# EAGLE design shrew-mega-integrated (EAGLE 7.6.0)
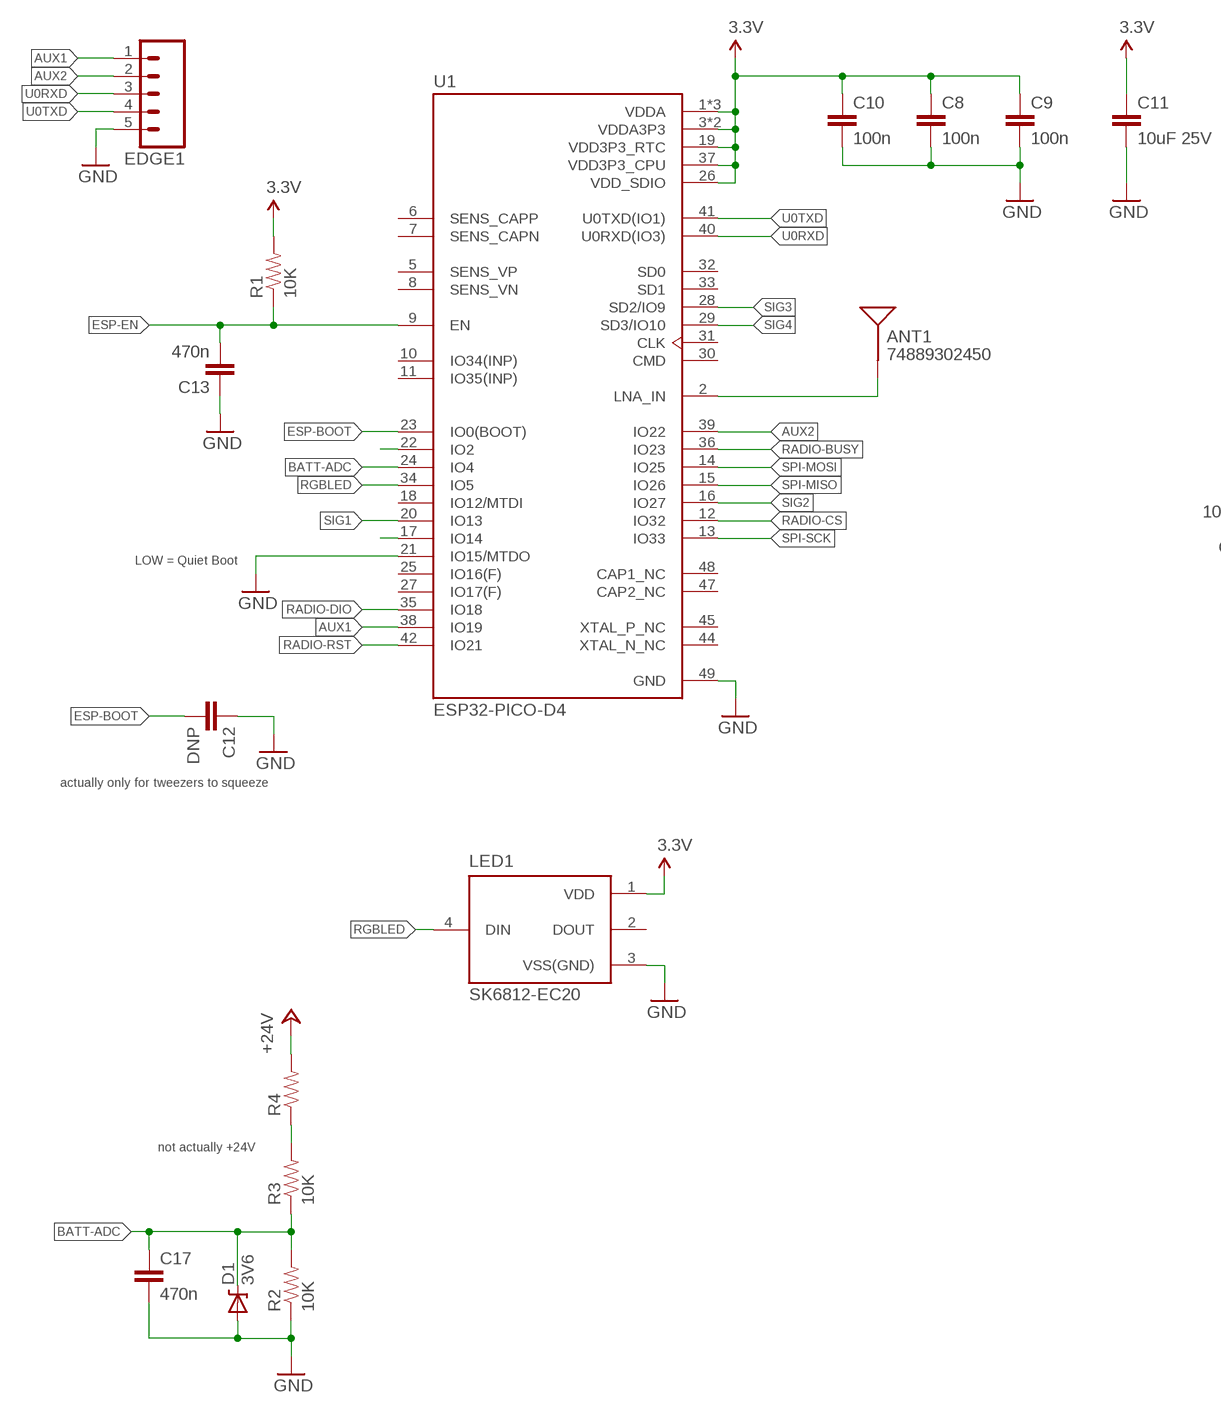
[diagram p0: schematic, sheet 1, part 1 of 2]
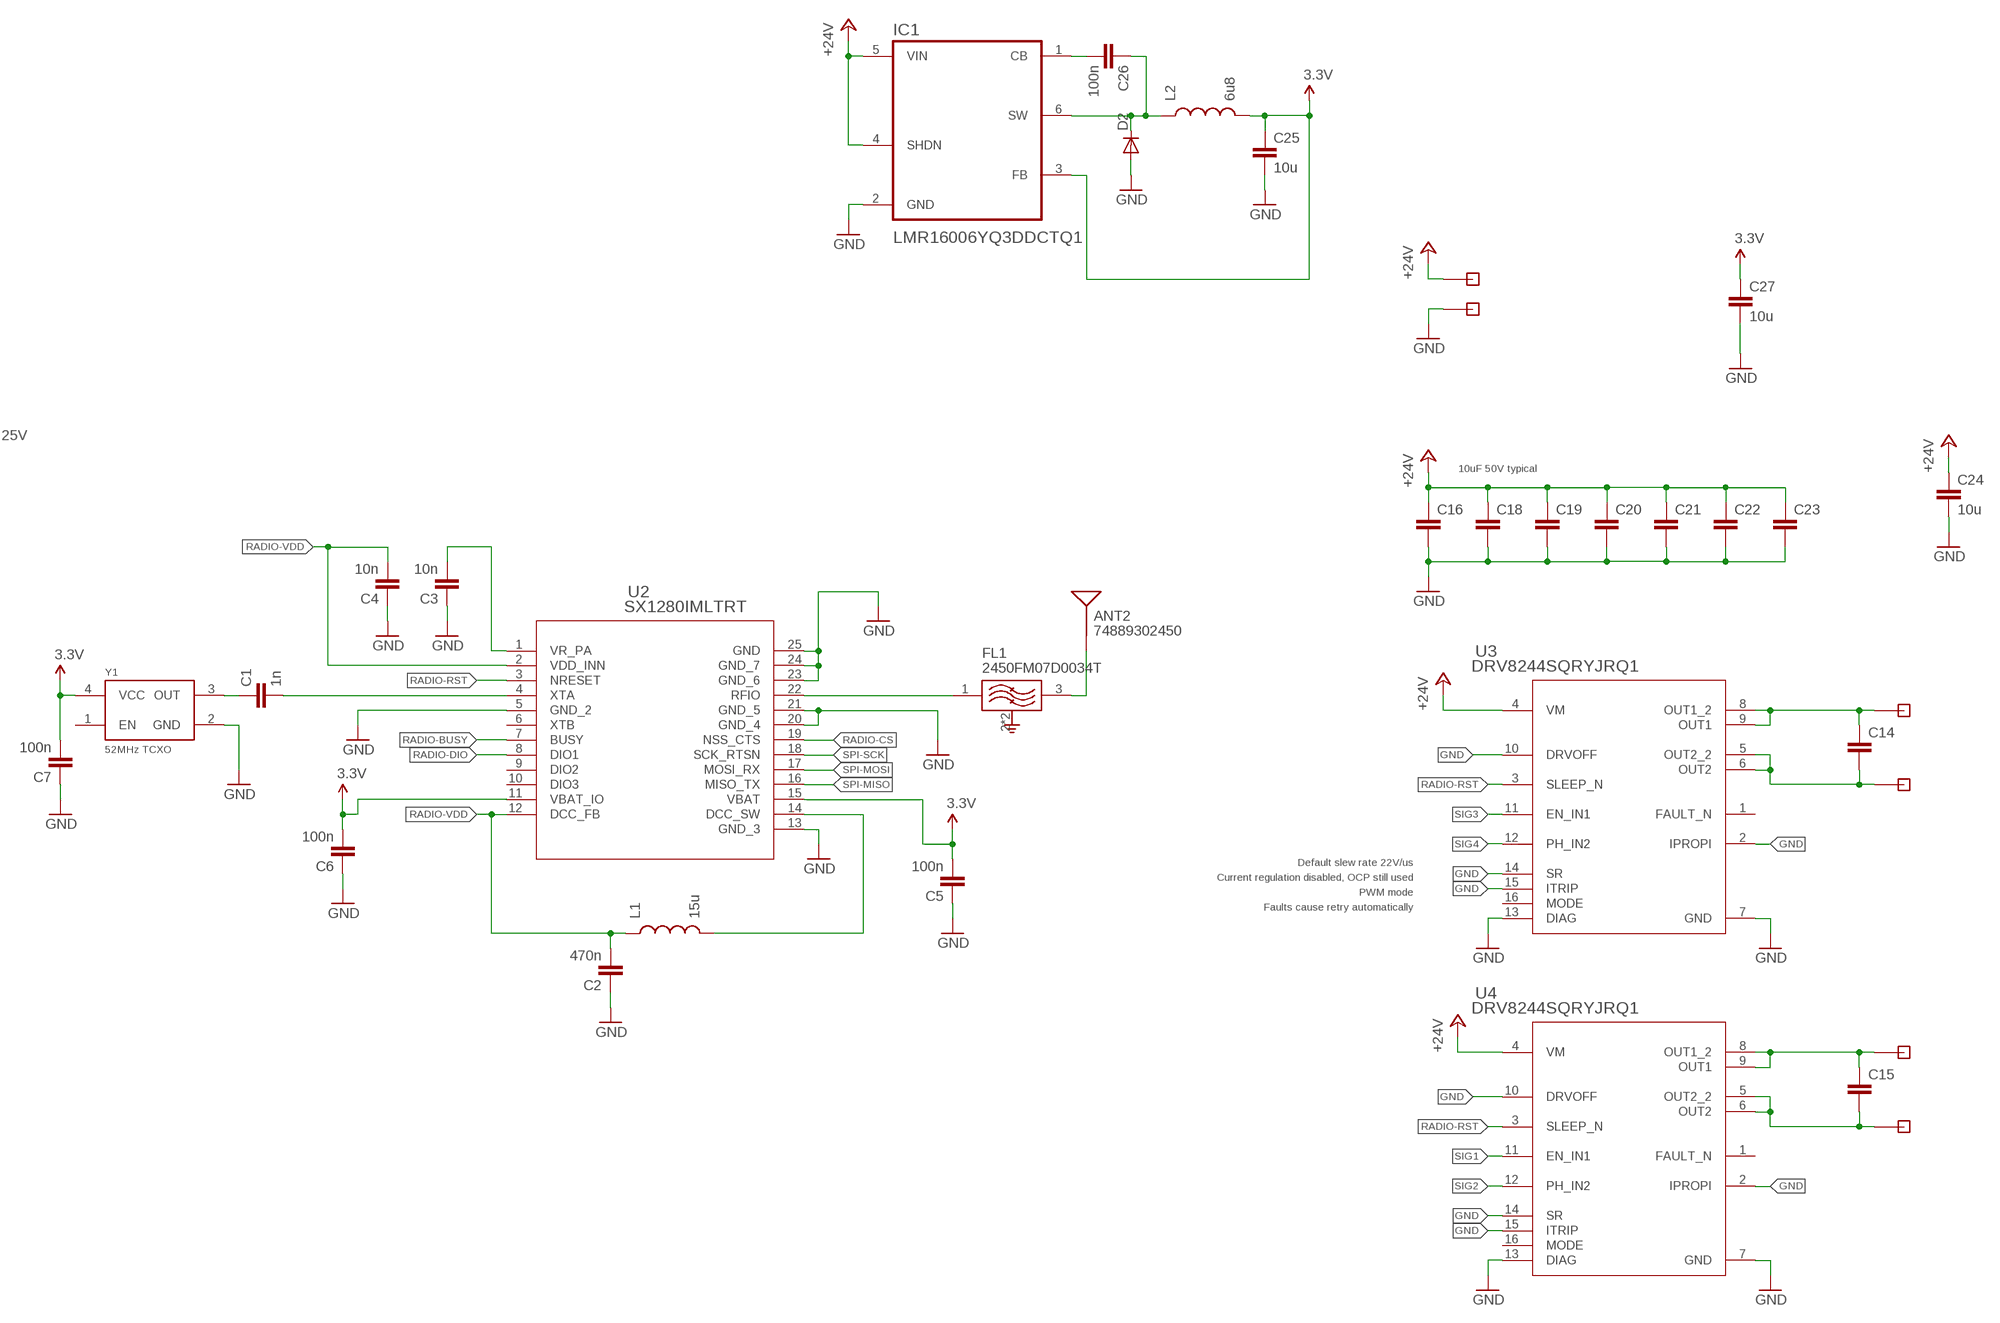
[diagram p1: schematic, sheet 1, part 2 of 2]

## Parts
ANT1  74889302450  ANTENNA2SMD  [ANTENNA-CHIP2]
ANT2  74889302450  ANTENNA2SMD  [ANTENNA-CHIP2]
C1  1n  CAP0402-REV  [0402-REV]
C2  470n  CAP0402-REV  [0402-REV]
C3  10n  CAP0402-REV  [0402-REV]
C4  10n  CAP0402-REV  [0402-REV]
C5  100n  CAP0402-REV  [0402-REV]
C6  100n  CAP0402-REV  [0402-REV]
C7  100n  CAP0402-REV  [0402-REV]
C8  100n  CAP0402-REV  [0402-REV]
C9  100n  CAP0402-REV  [0402-REV]
C10  100n  CAP0402-REV  [0402-REV]
C11  10uF 25V  CAP0805  [0805]
C12  DNP  CAP0402-CAP  [0402-CAP]
C13  470n  CAP0402-REV  [0402-REV]
C14  CAP0402-CAP  [0402-CAP]
C15  CAP0402-CAP  [0402-CAP]
C16  CAP0805  [0805]
C17  470n  CAP0402-REV  [0402-REV]
C18  CAP0805  [0805]
C19  CAP0805  [0805]
C20  CAP0805  [0805]
C21  CAP0805  [0805]
C22  CAP0805  [0805]
C23  CAP0805  [0805]
C24  10u  CAP0805  [0805]
C25  10u  CAP0805  [0805]
C26  100n  CAP0402-REV  [0402-REV]
C27  10u  CAP0805  [0805]
D1  3V6  DIODE-ZENER-BZT52  [SOD-323]
D2  DIODESOD  [SOD-323]
EDGE1  M05PTH  [1X05]
FL1  2450FM07D0034T  [FIL_2450FM07D0034T]
IC1  LMR16006YQ3DDCTQ1  LMR16006XDDCR  [SOT95P280X110-6N]
L1  15u  INDUCTOR0805  [0805]
L2  6u8  INDUCTOR0805  [0805]
LED1  SK6812-EC20  [SK6812-EC20]
R1  10K  RESISTOR0402-REV  [0402-REV]
R2  10K  RESISTOR0402-REV  [0402-REV]
R3  10K  RESISTOR0402-REV  [0402-REV]
R4  RESISTOR0402-RES  [0402-RES]
U1  ESP32-PICO-D4  [PQFN50P700X700X104-49N]
U2  SX1280IMLTRT  [QFN24_4X4_SEM]
U3  DRV8244SQRYJRQ1  [RYJ0016A-MFG]
U4  DRV8244SQRYJRQ1  [RYJ0016A-MFG]
X1  PIN-1X-BIG  [PAD-1X-BIG]
X2  PIN-1X-BIG  [PAD-1X-BIG]
X3  PIN-1X-BIG  [PAD-1X-BIG]
X4  PIN-1X-BIG  [PAD-1X-BIG]
X5  PIN-1X-BIG  [PAD-1X-BIG]
X6  PIN-1X-BIG  [PAD-1X-BIG]
Y1  52MHz TCXO  OSCILLATOR-TG2016SMN  [OSC_TG2016SMN_50.0000M-ECGNNMB]

## Nets
3.3V: C5.2 C6.2 C7.2 C8.1 C9.1 C10.1 C11.1 C25.1 C27.1 IC1.3(FB) L2.2 LED1.1(VDD) R1.2 U1.1(VDDA) U1.3(VDDA3P3) U1.4(VDDA3P3) U1.19(VDD3P3_RTC) U1.26(VDD_SDIO) U1.37(VDD3P3_CPU) U1.43(VDDA) U1.46(VDDA) U2.11(VBAT_IO) U2.15(VBAT) Y1.4(VCC)
+24V: C16.1 C18.1 C19.1 C20.1 C21.1 C22.1 C23.1 C24.1 IC1.4(SHDN) IC1.5(VIN) R4.2 U3.4(VM) U4.4(VM) X5.1
AUX1: EDGE1.1 U1.38(IO19)
AUX2: EDGE1.2 U1.39(IO22)
BATT-ADC: C17.1 D1.1(C) R2.2 R3.1 U1.24(IO4)
ESP-BOOT: C12.2 U1.23(IO0(BOOT))
ESP-EN: C13.2 R1.1 U1.9(EN)
GND: C2.1 C3.1 C4.1 C5.1 C6.1 C7.1 C8.2 C9.2 C10.2 C11.2 C12.1 C13.1 C16.2 C17.2 C18.2 C19.2 C20.2 C21.2 C22.2 C23.2 C24.2 C25.2 C27.2 D1.2(A) D2.2(A) EDGE1.5 IC1.2(GND) LED1.3(VSS(GND)) R2.1 U1.21(IO15/MTDO) U1.49(GND) U2.5(GND_2) U2.13(GND_3) U2.20(GND_4) U2.21(GND_5) U2.23(GND_6) U2.24(GND_7) U2.25(GND) U3.2(IPROPI) U3.7(GND) U3.10(DRVOFF) U3.13(DIAG) U3.14(SR) U3.15(ITRIP) U4.2(IPROPI) U4.7(GND) U4.10(DRVOFF) U4.13(DIAG) U4.14(SR) U4.15(ITRIP) X6.1 Y1.2(GND)
MOTOR1: C14.1 U3.8(OUT1_2) U3.9(OUT1) X2.1
MOTOR2: C14.2 U3.5(OUT2_2) U3.6(OUT2) X1.1
MOTOR3: C15.1 U4.8(OUT1_2) U4.9(OUT1) X4.1
MOTOR4: C15.2 U4.5(OUT2_2) U4.6(OUT2) X3.1
N$1: ANT1.FEED(SIGNAL) U1.2(LNA_IN)
N$2: C1.1 Y1.3(OUT)
N$3: C1.2 U2.4(XTA)
N$4: C26.2 IC1.1(CB)
N$5: U1.17(IO14)
N$6: FL1.1(IN) U2.22(RFIO)
N$7: ANT2.FEED(SIGNAL) FL1.3(OUT)
N$8: U1.22(IO2)
N$9: L1.2 U2.14(DCC_SW)
N$10: C26.1 D2.1(C) IC1.6(SW) L2.1
N$11: C3.2 U2.1(VR_PA)
RADIO-BUSY: U1.36(IO23) U2.7(BUSY)
RADIO-CS: U1.12(IO32) U2.19(NSS_CTS)
RADIO-DIO: U1.35(IO18) U2.8(DIO1)
RADIO-RST: U1.42(IO21) U2.3(NRESET) U3.3(SLEEP_N) U4.3(SLEEP_N)
RADIO-VDD: C2.2 C4.2 L1.1 U2.2(VDD_INN) U2.12(DCC_FB)
RGBLED: LED1.4(DIN) U1.34(IO5)
SIG1: U1.20(IO13) U4.11(EN_IN1)
SIG2: U1.16(IO27) U4.12(PH_IN2)
SIG3: U1.28(SD2/IO9) U3.11(EN_IN1)
SIG4: U1.29(SD3/IO10) U3.12(PH_IN2)
SPI-MISO: U1.15(IO26) U2.16(MISO_TX)
SPI-MOSI: U1.14(IO25) U2.17(MOSI_RX)
SPI-SCK: U1.13(IO33) U2.18(SCK_RTSN)
U0RXD: EDGE1.3 U1.40(U0RXD(IO3))
U0TXD: EDGE1.4 U1.41(U0TXD(IO1))
V-ADC: R3.2 R4.1
Unconnected: LED1.2(DOUT) U1.5(SENS_VP) U1.6(SENS_CAPP) U1.7(SENS_CAPN) U1.8(SENS_VN) U1.10(IO34(INP)) U1.11(IO35(INP)) U1.18(IO12/MTDI) U1.25(IO16(F)) U1.27(IO17(F)) U1.30(CMD) U1.31(CLK) U1.32(SD0) U1.33(SD1) U1.44(XTAL_N_NC) U1.45(XTAL_P_NC) U1.47(CAP2_NC) U1.48(CAP1_NC) U2.6(XTB) U2.9(DIO2) U2.10(DIO3) U3.1(FAULT_N) U3.16(MODE) U4.1(FAULT_N) U4.16(MODE) Y1.1(EN)

## Notes on the sheet
- 10uF 50V typical
- LOW = Quiet Boot
- Default slew rate 22V/us
- Current regulation disabled, OCP still used
- PWM mode
- Faults cause retry automatically
- actually only for tweezers to squeeze
- not actually +24V

## Power pins joined to a net without a drawn wire
GND: FL1.2(GND) FL1.4(GND)

## Library data of the parts
ANT1 ANT2 = shrew-common:ANTENNA2: Antenna Single endded antenna. Common with smaller chip antennas. CHIP4 package is the GPS Chip Antenna SKU: GPS-08418. CHIP5 package is 2.4GHz chip antenna SKU: WRL-00144.
C1-C27 = shrew-common:CAP: Capacitor Standard 0603 ceramic capacitor, and 0.1" leaded capacitor.
D1 = shrew-common:DIODE-ZENER: Zener Diode Production Part - 8199 3.4V Zener Voltage
D2 = shrew-common:DIODE: Diode These are standard reverse protection diodes and small signal diodes. SMA package can handle up to about 1A. SOD-323 can handle about 200mA. What the SOD-323 package when ordering, there are some mfgs out there that are 5-pin packages.
EDGE1 = shrew-common:M05: Header 5 Standard 5-pin 0.1" header. Use with straight break away headers (SKU : PRT-00116), right angle break away headers (PRT-00553), swiss pins (PRT-00743), machine pins (PRT-00117), and female headers (PRT-00115). Molex polarized connector foot print use with SKU : PRT-08230 with associated crimp pins and housings.
FL1 = shrew-core:2450FM07D0034T: 2.4GHz ~ 2.5GHz Frequency RF Filter (Radio Frequency) 100MHz Bandwidth 0.75dB 0402 (1005 Metric), 4 PC Pad Check availability <https://pricing.snapeda.com/parts/2450FM07D0034T/Johanson%20Technology%20Inc./view-part?ref=eda>; AVAILABILITY: In Stock; CHECK_PRICES: https://www.snapeda.com/parts/2450FM07D0034T/Johanson+Technology+Inc./view-part/?ref=eda; DESCRIPTION: 2.4GHz ~ 2.5GHz Frequency - RF Filter (Radio Frequency) 100MHz Bandwidth 0.75dB 0402 (1005 Metric), 4 PC Pad; MF: Johanson Technology Inc.; MP: 2450FM07D0034T; PACKAGE: 0402 Johanson Technology Inc.; PRICE: None; SNAPEDA_LINK: https://www.snapeda.com/parts/2450FM07D0034T/Johanson+Technology+Inc./view-part/?ref=snap
IC1 = shrew-core:LMR16006XDDCR: Check availability <https://pricing.snapeda.com/parts/LMR16006XDDCR/Texas%20Instruments/view-part?ref=eda>; AVAILABILITY: In Stock; CHECK_PRICES: https://www.snapeda.com/parts/LMR16006XDDCR/Texas+Instruments/view-part/?ref=eda; DESCRIPTION: SIMPLE SWITCHER&reg; 4V to 60V, 600mA Step-Down Regulator with Low Iq; MF: Texas Instruments; MP: LMR16006XDDCR; PACKAGE: SOT-23-THN-6 Texas Instruments; PRICE: None; SNAPEDA_LINK: https://www.snapeda.com/parts/LMR16006XDDCR/Texas+Instruments/view-part/?ref=snap
L1 L2 = shrew-common:INDUCTOR: Inductors Basic Inductor/Choke - 0603 and 1206. Footprints are not proven and vary greatly between part numbers.
LED1 = shrew-core:SK6812: SMD 5050 Full color RGB LED data transmission frequency up to 800Kbps, with 30 fps refresh rate, 5.00x5.00 mm Check availability <https://pricing.snapeda.com/parts/SK6812/Shenzhen%20LED%20Color%20Optoelectronic%20Inc./view-part?ref=eda>
R1-R4 = shrew-common:RESISTOR: Resistor Basic schematic elements and footprints for 0603, 1206, and PTH resistors.
U1 = shrew-core:ESP32-PICO-D4: Bluetooth, WiFi 802.11b/g/n, Bluetooth v4.2 +EDR, Class 1, 2 and 3 Transceiver Module 2.4GHz ~ 2.5GHz Surface Mount Check availability <https://pricing.snapeda.com/parts/ESP32-PICO-D4/Espressif%20Systems/view-part?ref=eda>; AVAILABILITY: In Stock; CHECK_PRICES: https://www.snapeda.com/parts/ESP32-PICO-D4/Espressif+Systems/view-part/?ref=eda; DESCRIPTION: Bluetooth, WiFi 802.11b/g/n, Bluetooth v4.2 +EDR, Class 1, 2 and 3 Transceiver Module 2.4GHz ~ 2.5GHz - Surface Mount; MF: Espressif Systems; MP: ESP32-PICO-D4; PACKAGE: SMD-48 Espressif Systems; PRICE: None; SNAPEDA_LINK: https://www.snapeda.com/parts/ESP32-PICO-D4/Espressif+Systems/view-part/?ref=snap
U2 = shrew-core:SX1280IMLTRT; COPYRIGHT: Copyright (C) 2024 Ultra Librarian. All rights reserved.; MANUFACTURER_PART_NUMBER: SX1280IMLTRT; MFR_NAME: Semtech
U3 U4 = shrew-core:DRV8244SQRYJRQ1; COPYRIGHT: Copyright (C) 2024 Ultra Librarian. All rights reserved.; MANUFACTURER_PART_NUMBER: DRV8244SQRYJRQ1; MFR_NAME: Texas Instruments; REFDES: RefDes; TYPE: TYPE
X1-X6 = shrew-core:PIN-1X
Y1 = shrew-common:OSCILLATOR

## Board
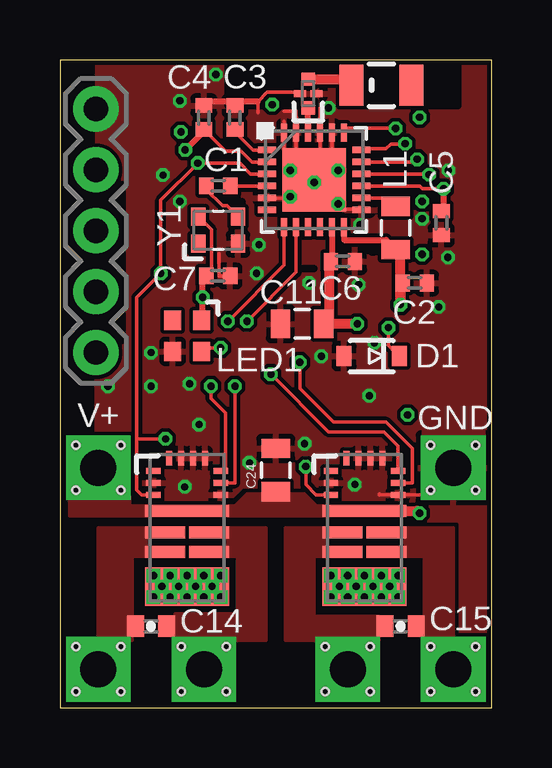
[diagram p2: board, top side]
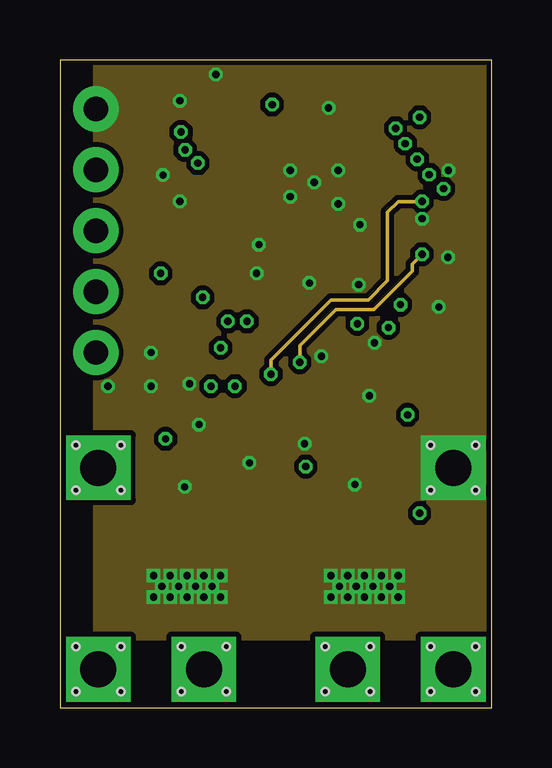
[diagram p3: board, inner layer Route2]
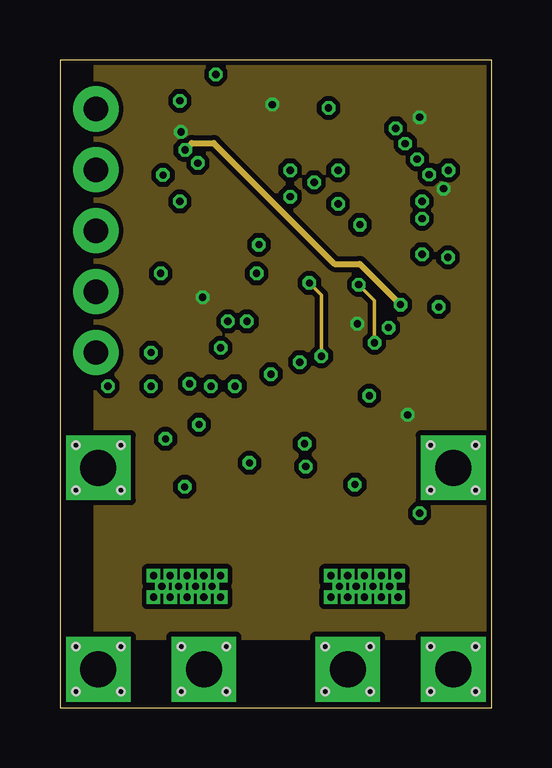
[diagram p4: board, inner layer Route15]
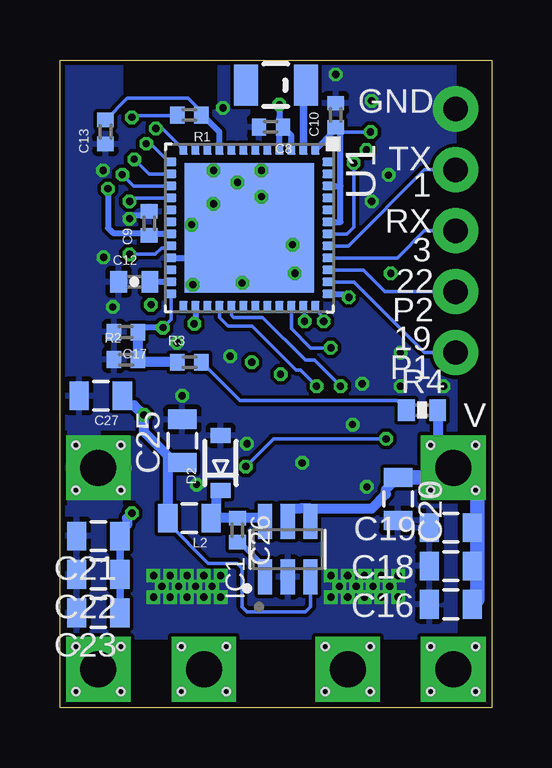
[diagram p5: board, bottom side, seen from below]

Size 18 x 27 mm. Coordinates in mm from the lower left corner, seen from the top.
Outline: 18,27 0,27 0,0 18,0 18,27
Copper layers (1+2*15+16): Top 0.035mm / dielectric 0.2mm / Route2 0.0175mm / dielectric 1.065mm / Route15 0.0175mm / dielectric 0.2mm / Bottom 0.035mm
Design rules "jlcpcb-4layers": minimum track width 3.5mil, minimum drill 0.2mm, track to track 5mil, track to pad 5mil, pad to pad 5mil, via to via 5mil, smd to smd 5mil, copper to edge 0.2mm, drill to drill 6mil, minimum pad ring 10mil, minimum via ring 0.13mm, stop-mask expansion 0.05mm, vias tented up to drill 16mil, thermal gap 8mil
tRestrict: area 12.4,25.1 to 14.2,26.8; area 7,25.1 to 9.9,27; area 14.2,25.1 to 16.6,26.8; 6 lines
bRestrict: area 11.6,25.1 to 15.2,26.8; 6 lines
vRestrict: area 11.6,25.1 to 15.2,26.8; area 7,25.4 to 10.8,27; area 15.2,25.1 to 16.6,26.8; 1 lines

### Footprints (pad centres in the part's own frame; a part is rotated, then mirrored left to right if it is on the bottom)
ANTENNA-CHIP2 = smd 1.7 x 1: ? 0,-1.25; FEED 0,1.25
0402-REV = smd 0.6 x 0.7: 1 -0.5,0; 2 0.5,0
0805 = smd 0.8 x 1.2: 1 -0.9,0; 2 0.9,0
0402-CAP = smd 0.7 x 0.9: 1 -0.65,0; 2 0.65,0
SOD-323 = smd 0.63 x 0.83: 1 -1.15,0; 2 1.15,0
1X05 = drill 1.016 pad 1.88: 1 0,0; 2 2.54,0; 3 5.08,0; 4 7.62,0; 5 10.16,0
FIL_2450FM07D0034T = smd 0.55 x 0.55: 1 -0.6,0; 3 0.6,0 | smd 0.3 x 0.5: 2 0,-0.35; 4 0,0.35
SOT95P280X110-6N = smd 1.45 x 0.59: 1 -1.155,0.95; 2 -1.155,0; 3 -1.155,-0.95; 4 1.155,-0.95; 5 1.155,0; 6 1.155,0.95
SK6812-EC20 = smd 0.8 x 0.7: 1 0.65,-0.6; 2 0.65,0.6; 3 -0.65,0.6; 4 -0.65,-0.6
0402-RES = smd 0.7 x 0.9: 1 -0.65,0; 2 0.65,0
PQFN50P700X700X104-49N = smd 0.45 x 0.35: 1 -3.265,2.75; 2 -3.265,2.25; 3 -3.265,1.75; 4 -3.265,1.25; 5 -3.265,0.75; 6 -3.265,0.25; 7 -3.265,-0.25; 8 -3.265,-0.75; 9 -3.265,-1.25; 10 -3.265,-1.75; 11 -3.265,-2.25; 12 -3.265,-2.75; 25 3.265,-2.75; 26 3.265,-2.25; 27 3.265,-1.75; 28 3.265,-1.25; 29 3.265,-0.75; 30 3.265,-0.25; 31 3.265,0.25; 32 3.265,0.75; 33 3.265,1.25; 34 3.265,1.75; 35 3.265,2.25; 36 3.265,2.75 | smd 0.35 x 0.45: 13 -2.75,-3.265; 14 -2.25,-3.265; 15 -1.75,-3.265; 16 -1.25,-3.265; 17 -0.75,-3.265; 18 -0.25,-3.265; 19 0.25,-3.265; 20 0.75,-3.265; 21 1.25,-3.265; 22 1.75,-3.265; 23 2.25,-3.265; 24 2.75,-3.265; 37 2.75,3.265; 38 2.25,3.265; 39 1.75,3.265; 40 1.25,3.265; 41 0.75,3.265; 42 0.25,3.265; 43 -0.25,3.265; 44 -0.75,3.265; 45 -1.25,3.265; 46 -1.75,3.265; 47 -2.25,3.265; 48 -2.75,3.265 | smd 5.4 x 5.4: 49 0,0
QFN24_4X4_SEM = smd 0.762 x 0.254: 1 -1.968,1.25; 2 -1.968,0.75; 3 -1.968,0.25; 4 -1.968,-0.25; 5 -1.968,-0.75; 6 -1.968,-1.25; 13 1.968,-1.25; 14 1.968,-0.75; 15 1.968,-0.25; 16 1.968,0.25; 17 1.968,0.75; 18 1.968,1.25 | smd 0.254 x 0.762: 7 -1.25,-1.968; 8 -0.75,-1.968; 9 -0.25,-1.968; 10 0.25,-1.968; 11 0.75,-1.968; 12 1.25,-1.968; 19 1.25,1.968; 20 0.75,1.968; 21 0.25,1.968; 22 -0.25,1.968; 23 -0.75,1.968; 24 -1.25,1.968 | smd 2.642 x 2.642: 25 0,0
RYJ0016A-MFG = smd 0.6 x 0.25: 1 -1.4,2.375; 2 -1.4,1.875; 3 -1.4,1.375; 10 1.4,1.375; 11 1.4,1.875; 12 1.4,2.375 | smd 3.5 x 0.5: 4 0,0.7 | smd 1.675 x 0.5: 5 -0.913,-0.2; 6 -0.913,-1; 8 0.913,-1; 9 0.913,-0.2 | smd 3.5 x 1.6: 7 0,-2.45 | smd 0.25 x 0.6: 13 0.75,2.9; 14 0.25,2.9; 15 -0.25,2.9; 16 -0.75,2.9
PAD-1X-BIG = drill 1.5 pad 2.5 square: 1 0,0 | hole 0.3: -0.94,0.94; 0.94,0.94; -0.94,-0.94; 0.94,-0.94
OSC_TG2016SMN_50.0000M-ECGNNMB = smd 0.75 x 0.6: 1 -0.565,0.825; 2 -0.565,-0.825; 3 0.565,-0.825; 4 0.565,0.825

### Placement (x,y rotation side)
ANT1  9,25.95 270 bottom
ANT2  13.4,25.95 90 top
C1  6.6,21.75 0 top
C2  14.8,17.7 180 top
C3  7.3,24.6 270 top
C4  6,24.6 270 top
C5  15.9,20.2 90 top
C6  11.8,18.6 180 top
C7  6.6,18 180 top
C8  9.2,24.2 180 bottom
C9  14.28,20.18 90 bottom
C10  6.5,24.7 90 bottom
C11  10.1,16 180 top
C12  14.9,17.75 0 bottom
C13  16.1,24 90 bottom
C14  3.8,3.39 180 top
C15  14.2,3.39 180 top
C16  1.7,4.3 180 bottom
C17  15.25,15.65 180 bottom
C18  1.7,5.9 180 bottom
C19  1.7,7.5 180 bottom
C20  3.9,8.7 270 bottom
C21  16.4,7.15 180 bottom
C22  16.4,5.55 180 bottom
C23  16.4,3.95 180 bottom
C24  9,9.9 90 top
C25  12.9,11.12 90 bottom
C26  10.6,7.4 270 bottom
C27  16.3,13 180 bottom
D1  13,14.65 180 top
D2  11.3,10.2 90 bottom
EDGE1  1.5,14.8 90 top
FL1  10.35,25.6 90 top
IC1  8.5,6.6 90 bottom
L1  14,20 90 top
L2  12.6,7.9 180 bottom
LED1  5.3,15.5 90 top
R1  12.6,24.7 180 bottom
R2  15.25,14.51 0 bottom
R3  12.6,14.4 0 bottom
R4  2.9,12.4 0 bottom
U1  10.1,20 270 bottom
U2  10.6,22 0 top
U3  5.3,7.5 0 top
U4  12.7,7.5 0 top
X1  1.6,1.6 0 top
X2  6,1.6 0 top
X3  12,1.6 0 top
X4  16.4,1.6 0 top
X5  1.6,10 0 top
X6  16.4,10 0 top
Y1  6.6,19.9 90 top

### Tracks (layer width: path | path; a pad name or v marks a point on that pad's centre or on a via)
3.3V  (via drill 0.3)
  Top 0.152: Y1.4 6.32,19.92 6.32,18 C7.2 | U2.15 15,21.75 15.12,21.63 v16,21.63
  Top 0.254: U2.11 11.35,18.9 C6.2 | 5.78,20.5 Y1.4 | LED1.1 5.95,16.2 v5.95,17.1 5.95,18 C7.2 | C5.2 16,20.7 v16,21.63
  Top 0.406: v12.4,16 11.15,16 11.15,16.15 C11.1 11.21,16 11.21,18.51 C6.2
  Bottom 0.152: v5.05,24 6.3,24 6.36,24 | v15,24.61 14.94,24.67 13.1,24.67 R1.2 | IC1.3 7.55,4.21 7.76,4 10.2,4 10.4,4.2 10.4,5.8 10.62,6.02 11.82,6.02 13.5,7.7 L2.2
  Bottom 0.254: U1.3 8.35,23.85 C8.1 | U1.4 8.85,23.9 C8.1 | v8.85,25.14 8.85,24.6 C8.1 | U1.1 6.57,24.05 C10.1 6.3,24.05 6.3,24 6.3,21.75 | U1.46 6.3,21.75 | U1.43 6.3,20.25 6.3,21.75 | U1.37 5.95,17.25 v5.95,17.1 | v16,21.63 16,20 15.79,19.79 14.28,19.79 C9.1 14.28,19.75 U1.19 | U1.26 12.35,16.05 v12.4,16
  Bottom 0.406: C27.1 15.4,12.6 14.9,12.6 v14.5,12.2 14.5,11.5 13.5,10.5 13.5,10.22 | L2.2 13.5,10.22 | C25.1 13.5,10.22
  pour Route15 (isolate 0.203, no thermals): 1.5,2.9 1.5,27 18,27 18,2.9
+24V  (via drill 0.3)
  Top 0.406: U4.4 14.9,8.2 v15,8.1
  Bottom 0.305: 15.2,7.6 15.5,7.3 C21.1 C22.1 C23.1 | C16.1 0.6,4.7 0.6,4.5 | C18.1 0.6,6.2 0.6,5.8 | C19.1 0.6,7.7 0.6,8
  Bottom 0.406: v15,8.1 15.2,7.9 15.2,7.6 | R4.2 2.25,10.65 X5.1 | IC1.5 8.5,8.3 8,8.3 7.55,8.3 | 7.55,8.3 5,8.3 4.4,8.9 4.4,9.1 C20.1 | IC1.4 7.55,8.3
  Bottom 0.6: 0.6,4.5 0.6,5.8 0.6,8 0.6,9 X5.1 2,9.6 C20.1
  pour Top (isolate 0.152, no thermals): 3.7,8 0.4,8 0.4,8.8 2.9,8.8 2.9,8.4 3.7,8.4
  pour Top (isolate 0.152, no thermals): 7,8.4 7.3,8.4 7.8,8.9 10.2,8.9 10.7,8.4 11,8.4 11,8 7,8
AUX1
  Bottom 0.152: U1.38 5.75,17.75 2.8,14.8 EDGE1.1
AUX2
  Bottom 0.152: U1.39 5.35,18.25 4.44,17.34 EDGE1.2
BATT-ADC  (via drill 0.3)
  Top 0.152: D1.1 13.7,15.1 v13.7,15.84
  Bottom 0.152: v13.7,15.84 13.37,16.18 U1.24
  Bottom 0.254: v13.7,15.84 14.75,15.84 C17.1
  Bottom 0.406: C17.1 R2.2 14.5,14.4 R3.1
ESP-BOOT
  Bottom 0.152: C12.2 14.2,17.75
  Bottom 0.254: U1.23 14.2,17.75
ESP-EN
  Bottom 0.152: C13.2 15.2,25.4 12.66,25.4 12.1,24.84 R1.1
  Bottom 0.254: U1.9 11.35,24 12.05,24.7 R1.1
GND  (via drill 0.3)
  Top 0.152: v11.2,25 10.85,25 U2.21 | 6.63,18.93 6.63,18 6.99,18 | U2.5 10.6,21.25 U2.25 | 12.44,20.78 10.6,20.78 U2.25 | 11.35,23.79 11.35,22 U2.25 | U2.21 10.85,22 U2.25 | U2.25 9.85,22 U2.23 9.85,24.87 9.35,24.87 | 9.35,24.45 9.35,22 U2.25 | 10.04,25.66 8.64,25.66 8.25,25.27 8.25,24.8 | U2.21 10.85,22.4 v11.6,22.4 | 13.33,8.91 13.33,8.87 15.22,8.87
  Top 0.254: 8.25,25.27 7.3,25.27 | 7.3,25.27 6.07,25.27 | C3.1 7.3,25.27
  Route15 0.152: v12.46,17.62 13.12,16.96 v13.12,15.21 | v10.9,14.65 10.9,17.2 v10.41,17.69
  Bottom 0.152: U1.49 10.6,20.5 v10.6,21.9
  Bottom 0.254: U1.21 12.46,18.75 v12.46,17.63 | C9.2 14.45,20.51 15.1,20.51 v15.1,20.38
  Bottom 0.6: 15.3,10 X6.1
  other vias: 12.51,20.13 16.18,18.77 9.6,22.4 9.6,21.3 11.6,21 8.3,19.3 8.2,18.1 5,21.1 5,25.3 6.5,26.4 16.2,22.4 15.8,16.7 4.3,22.2 3.9,5.5 3.9,4.6 5.3,4.6 5.3,5.5 4.6,4.6 4.6,5.5 12.7,4.6 12.7,5.5 14.1,5.5 14.1,4.6 13.4,5.5 13.4,4.6 13.05,5.05 13.75,5.05 4.25,5.05 4.95,5.05 5.2,9.2 12.3,9.3 5.65,5.05 6,5.5 6,4.6 6.35,5.05 6.7,5.5 6.7,4.6 12.35,5.05 12,4.6 12,5.5 11.65,5.05 11.3,5.5 11.3,4.6 7.9,10.2 10.2,11 5.4,13.5 3.8,14.8 2,13.4 3.8,13.4 12.9,13 5.8,11.8
  pour Top (isolate 0.152, rank 5): 1.5,2.9 1.5,27 18,27 18,2.9
  pour Bottom (isolate 0.152, rank 5): 1.5,2.9 1.5,27 18,27 18,2.9
  pour Route2 (isolate 0.203, no thermals): 1.5,2.9 1.5,27 18,27 18,2.9
  pour Top (isolate 0.152, no thermals): 1.5,27 1.5,22.5 4.1,22.5 4.1,27
  pour Bottom (isolate 0.152, no thermals): 1.5,27 4.1,27 4.1,22.5 1.5,22.5
  pour Bottom (isolate 0.254, no thermals): 14.8,11.2 16.4,11.2 16.4,11.8 17.6,11.8 17.6,8.3 14.8,8.3
  pour Top (isolate 0.254, no thermals): 17.7,12.4 15.2,12.4 15.2,11.1 17.7,11.1
MOTOR1
  pour Top (isolate 0.152, no thermals): 7,7.5 8.6,7.5 8.6,2.8 4.8,2.8 4.8,3.9 7.4,3.9 7.4,6.3 7,6.3
MOTOR2
  pour Top (isolate 0.152, no thermals): 3.6,7.5 1.6,7.5 1.6,2.8 3,2.8 3,6.3 3.6,6.3
MOTOR3
  pour Top (isolate 0.152, no thermals): 14.4,7.48 16.4,7.48 16.4,2.8 15.2,2.8 15.2,6.3 14.4,6.3
MOTOR4
  pour Top (isolate 0.152, no thermals): 11,7.5 9.4,7.5 9.4,2.8 13.3,2.8 13.3,3.8 10.6,3.8 10.6,6.3 11,6.3
N$1
  Bottom 0.305: U1.2 7.85,25.95 ANT1.FEED
N$2
  Top 0.152: Y1.3 6.97,20.92 6.78,20.92 6.1,21.6 C1.1
N$3
  Top 0.152: C1.2 U2.4
N$4
  Bottom 0.203: IC1.1 9.45,5.85 10.4,6.8 C26.2
N$6
  Top 0.25: U2.22 FL1.1
N$7
  Top 0.406: FL1.3 12.15,26.2 ANT2.FEED
N$9
  Top 0.152: U2.14 13.6,21.25 L1.2
N$10
  Bottom 0.406: IC1.6 9.45,7.9 C26.1 L2.1 11.5,7.9 11.5,8.85 D2.1
N$11
  Top 0.152: U2.1 8.05,23.25 7.35,23.95 C3.2
RADIO-BUSY  (via drill 0.3)
  Top 0.152: U2.7 9.35,18.45 v7,16.1
  Bottom 0.152: v7,16.1 7.12,16.22 7.03,16.29 7.35,16.61 U1.36
RADIO-CS  (via drill 0.3)
  Top 0.152: v14,24.15 11.85,24.15 U2.19
  Bottom 0.152: U1.12 13.73,24.15 v14,24.15
RADIO-DIO  (via drill 0.3)
  Top 0.152: U2.8 9.85,18.15 v7.8,16.1
  Bottom 0.152: U1.35 7.8,16.73 v7.8,16.1
RADIO-RST  (via drill 0.3)
  Top 0.152: U2.3 7.95,22.25 7.5,22.7 v5.75,22.7 4.2,21.15 v4.2,18.1 3.2,17.1 3.2,11.2 | 3.2,11.2 3.2,9.08 3.4,8.88 U3.3 | 3.2,11.2 v4.4,11.2 | v10.25,10.05 10.25,9.3 10.68,8.88 U4.3
  Bottom 0.152: U1.42 6.04,19.75 5.75,20.04 v5.75,22.7 | v10.25,10.05 9.1,11.2 v4.4,11.2
RADIO-VDD  (via drill 0.3)
  Top 0.152: U2.2 8.01,22.75 7.56,23.2 6.9,23.2 C4.2 6,23.97 5.94,23.97
  Top 0.254: 13.8,19.1 L1.1 13.6,19.5 11.85,19.5 U2.12 | v5.22,23.25 5.94,23.97
  Top 0.406: L1.1 14.2,19.1 v14.2,16.8 14.2,17.7 C2.2
  Route15 0.254: v5.22,23.25 5.5,23.53 6.42,23.53 11.45,18.5 12.5,18.5 v14.2,16.8
RGBLED  (via drill 0.3)
  Top 0.152: LED1.4 6.05,15 v6.7,15
  Bottom 0.152: v6.7,15 7.55,15 8.35,15.8 U1.34
SIG1  (via drill 0.3)
  Top 0.152: U4.11 14.7,9.38 14.7,10.8 13.6,11.9 11.4,11.9 10,13.3 v10,14.4
  Route2 0.152: v10,14.4 10,15.1 11.5,16.6 13.1,16.6 14.7,18.2 14.7,18.5 v15.1,18.9
  Bottom 0.152: v15.1,18.9 14.03,18.9 13.76,19.16 13.37,19.16 U1.20
SIG2  (via drill 0.3)
  Top 0.152: U4.12 14.1,10.9 13.5,11.5 11.2,11.5 v8.8,13.9
  Route2 0.152: v8.8,13.9 8.8,14.5 11.3,17 12.86,17 13.66,17.8 13.66,20.65 14.11,21.1 v15.1,21.1
  Bottom 0.152: U1.16 14.95,21.25 v15.1,21.1
SIG3  (via drill 0.3)
  Top 0.152: U3.11 7.3,9.38 v7.3,13.4
  Bottom 0.152: v7.3,13.4 7.97,14.07 8.15,14.07 9.98,15.9 10.98,15.9 11.35,16.27 U1.28
SIG4  (via drill 0.3)
  Top 0.152: U3.12 6.9,9.88 6.9,12.29 6.3,12.89 v6.3,13.4
  Bottom 0.152: U1.29 10.85,16.36 10.76,16.27 9.55,16.27 7.76,14.48 7.38,14.48 v6.3,13.4
SPI-MISO  (via drill 0.3)
  Top 0.152: U2.16 15.37,22.25 v15.4,22.22
  Bottom 0.152: U1.15 14.93,21.75 v15.4,22.22
SPI-MOSI  (via drill 0.3)
  Top 0.152: U2.17 14.79,22.75 v14.9,22.86
  Bottom 0.152: U1.14 14.29,22.25 v14.9,22.86
SPI-SCK  (via drill 0.3)
  Top 0.152: U2.18 12.85,23.25 12.9,23.3 13.59,23.3 13.8,23.5 v14.39,23.5 arc90 v14.4,23.51
  Bottom 0.152: U1.13 13.45,22.75 14.21,23.51 v14.4,23.51
U0RXD
  Bottom 0.152: U1.40 3.93,18.75 2.8,19.88 EDGE1.3
U0TXD
  Bottom 0.152: U1.41 5.97,19.25 2.8,22.42 EDGE1.4
V-ADC
  Bottom 0.152: R4.1 3.95,12.8 10.5,12.8 R3.2

### Text on the board
tPlace: V+ | GND
bPlace: GND | TX | 1 | RX | 3 | 22 | P2 | 19 | P1 | V